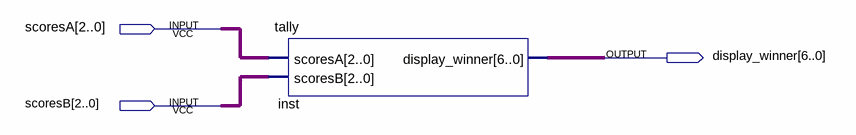
[diagram p0: schematic sheet]
// Quartus schematic JudgeCodingChallenge.bdf as structural Verilog: 1 symbols, 3 pins
module JudgeCodingChallenge (
  input  [2:0] scoresA,
  input  [2:0] scoresB,
  output [6:0] display_winner
);

  tally inst (.scoresA(scoresA), .scoresB(scoresB), .display_winner(display_winner));
endmodule
